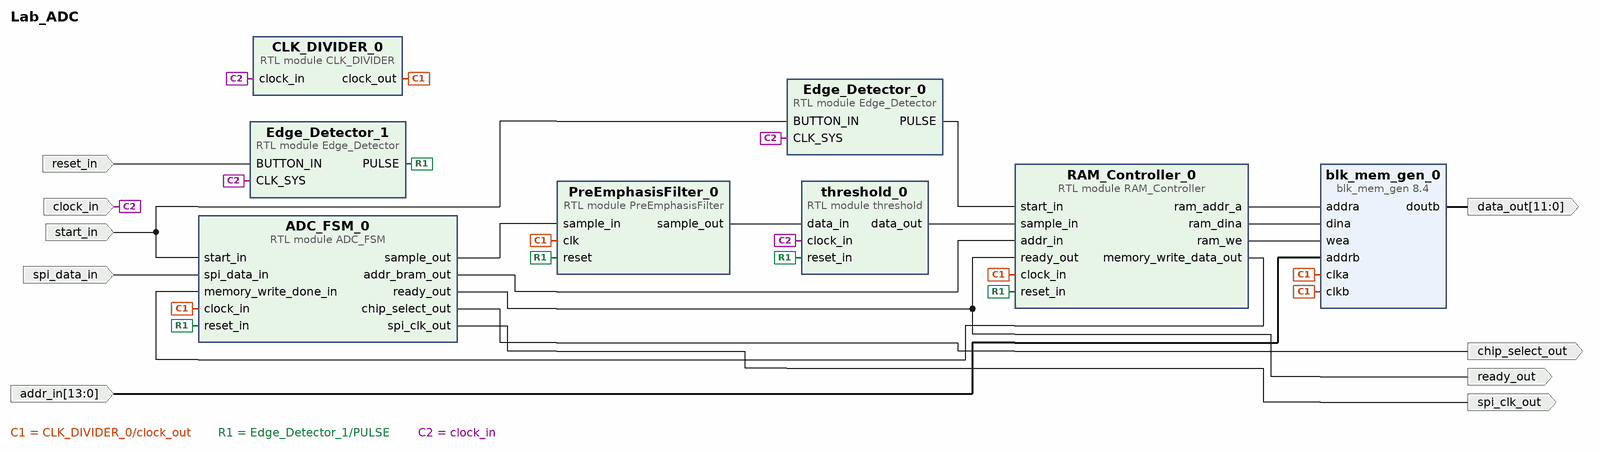
[diagram p0: block diagram of the top level]
# Vivado block design Lab_ADC, xc7a35tcpg236-1, Vivado 2019.1
create_bd_design Lab_ADC

create_bd_port -dir I -from 13 -to 0 addr_in
create_bd_port -dir O chip_select_out
create_bd_port -dir I -type clk clock_in
set_property -dict {CONFIG.FREQ_HZ 100000000} [get_bd_ports clock_in]
create_bd_port -dir O -from 11 -to 0 data_out
create_bd_port -dir O ready_out
create_bd_port -dir I reset_in
create_bd_port -dir O spi_clk_out
create_bd_port -dir I -type data spi_data_in
create_bd_port -dir I start_in

create_bd_cell -type module -reference CLK_DIVIDER CLK_DIVIDER_0
create_bd_cell -type module -reference Edge_Detector Edge_Detector_0
create_bd_cell -type module -reference Edge_Detector Edge_Detector_1
create_bd_cell -type ip -vlnv xilinx.com:ip:blk_mem_gen:8.4 blk_mem_gen_0
set_property -dict [list \
  CONFIG.Enable_32bit_Address false \
  CONFIG.Enable_A Always_Enabled \
  CONFIG.Enable_B Always_Enabled \
  CONFIG.Memory_Type Simple_Dual_Port_RAM \
  CONFIG.Operating_Mode_A NO_CHANGE \
  CONFIG.Port_B_Clock 100 \
  CONFIG.Port_B_Enable_Rate 100 \
  CONFIG.Read_Width_B 12 \
  CONFIG.Register_PortB_Output_of_Memory_Primitives false \
  CONFIG.Use_Byte_Write_Enable false \
  CONFIG.Write_Depth_A 16384 \
  CONFIG.Write_Width_A 12 \
  CONFIG.Write_Width_B 12 \
  CONFIG.use_bram_block Stand_Alone \
] [get_bd_cells blk_mem_gen_0]
create_bd_cell -type module -reference PreEmphasisFilter PreEmphasisFilter_0
create_bd_cell -type module -reference RAM_Controller RAM_Controller_0
create_bd_cell -type module -reference threshold threshold_0
create_bd_cell -type module -reference ADC_FSM ADC_FSM_0

# ---- connections ----

connect_bd_net [get_bd_pins ADC_FSM_0/addr_bram_out] [get_bd_pins RAM_Controller_0/addr_in]
connect_bd_net [get_bd_pins ADC_FSM_0/chip_select_out] [get_bd_ports chip_select_out]
connect_bd_net [get_bd_pins ADC_FSM_0/ready_out] [get_bd_ports ready_out] [get_bd_pins RAM_Controller_0/ready_out]
connect_bd_net [get_bd_pins ADC_FSM_0/sample_out] [get_bd_pins PreEmphasisFilter_0/sample_in]
connect_bd_net [get_bd_pins ADC_FSM_0/spi_clk_out] [get_bd_ports spi_clk_out]
connect_bd_net [get_bd_pins CLK_DIVIDER_0/clock_out] \
  [get_bd_pins blk_mem_gen_0/clkb] [get_bd_pins blk_mem_gen_0/clka] [get_bd_pins PreEmphasisFilter_0/clk] \
  [get_bd_pins RAM_Controller_0/clock_in] [get_bd_pins ADC_FSM_0/clock_in]
connect_bd_net [get_bd_pins Edge_Detector_0/PULSE] [get_bd_pins RAM_Controller_0/start_in]
connect_bd_net [get_bd_pins Edge_Detector_1/PULSE] \
  [get_bd_pins PreEmphasisFilter_0/reset] [get_bd_pins RAM_Controller_0/reset_in] [get_bd_pins threshold_0/reset_in] \
  [get_bd_pins ADC_FSM_0/reset_in]
connect_bd_net [get_bd_pins PreEmphasisFilter_0/sample_out] [get_bd_pins threshold_0/data_in]
connect_bd_net [get_bd_pins RAM_Controller_0/memory_write_data_out] [get_bd_pins ADC_FSM_0/memory_write_done_in]
connect_bd_net [get_bd_pins RAM_Controller_0/ram_addr_a] [get_bd_pins blk_mem_gen_0/addra]
connect_bd_net [get_bd_pins RAM_Controller_0/ram_dina] [get_bd_pins blk_mem_gen_0/dina]
connect_bd_net [get_bd_pins RAM_Controller_0/ram_we] [get_bd_pins blk_mem_gen_0/wea]
connect_bd_net [get_bd_ports addr_in] [get_bd_pins blk_mem_gen_0/addrb]
connect_bd_net [get_bd_pins blk_mem_gen_0/doutb] [get_bd_ports data_out]
connect_bd_net [get_bd_ports clock_in] \
  [get_bd_pins CLK_DIVIDER_0/clock_in] [get_bd_pins Edge_Detector_0/CLK_SYS] [get_bd_pins Edge_Detector_1/CLK_SYS] \
  [get_bd_pins threshold_0/clock_in]
connect_bd_net [get_bd_ports reset_in] [get_bd_pins Edge_Detector_1/BUTTON_IN]
connect_bd_net [get_bd_ports spi_data_in] [get_bd_pins ADC_FSM_0/spi_data_in]
connect_bd_net [get_bd_ports start_in] [get_bd_pins Edge_Detector_0/BUTTON_IN] [get_bd_pins ADC_FSM_0/start_in]
connect_bd_net [get_bd_pins threshold_0/data_out] [get_bd_pins RAM_Controller_0/sample_in]

validate_bd_design
save_bd_design
